# EAGLE design Wifi and Tip 120 (EAGLE 9.6.0)
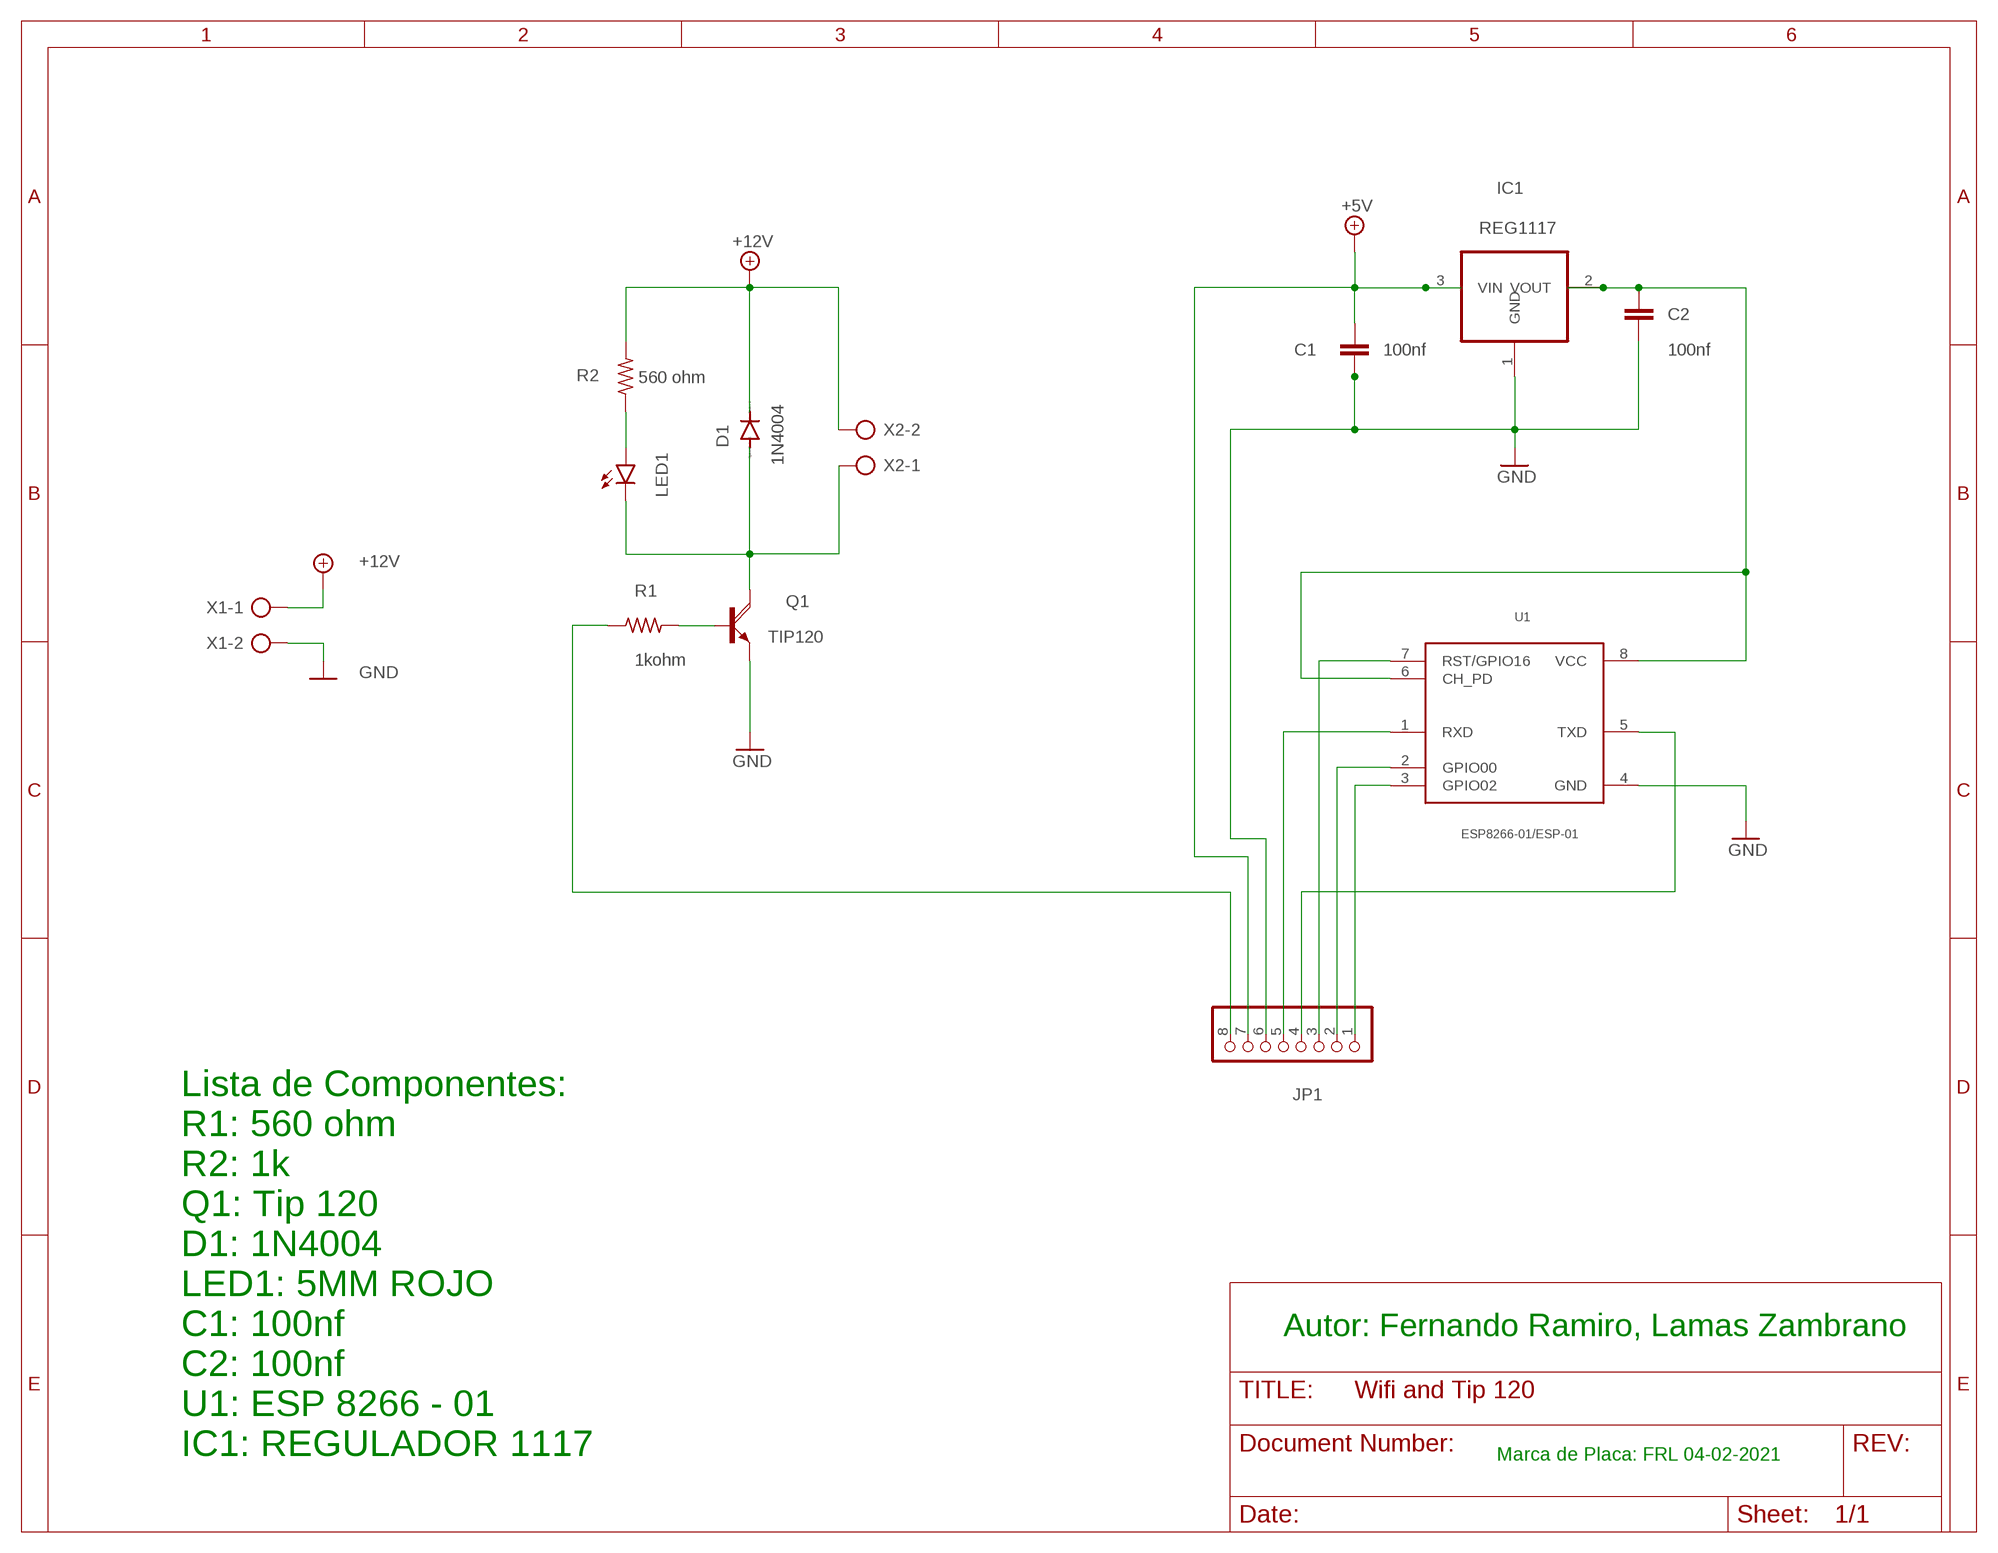
[diagram p0: schematic, sheet 1]

## Parts
C1  100nf  C-EU025-024X044  [C025-024X044]
C2  100nf  C-EU025-024X044  [C025-024X044]
D1  1N4004  [DO41-10]
IC1  REG1117  [SOT223]
JP1  PINHD-1X8  [1X08]
LED1  LED5MM  [LED5MM]
Q1  TIP120  [TO220AH]
R1  1kohm  R-US_0207/10  [0207/10]
R2  560 ohm  R-US_0207/10  [0207/10]
U1  ESP8266-01/ESP-01  [XCVR_ESP8266-01/ESP-01]
X1  AK500/2  [AK500/2]
X2  AK500/2  [AK500/2]

## Nets
+5V: C1.1 IC1.3(VIN) JP1.7
+12V: D1.C R2.2 X1.1 X2.2
GND: C1.2 C2.2 IC1.1(GND) JP1.6 Q1.E U1.4(GND) X1.2
N$1: Q1.B R1.2
N$2: D1.A LED1.K(C) Q1.C X2.1
N$3: LED1.A R2.1
N$4: JP1.8 R1.1
N$5: JP1.5 U1.1(RXD)
N$6: C2.1 IC1.2(VOUT) U1.6(CH_PD) U1.8(VCC)
N$7: JP1.4 U1.5(TXD)
N$8: JP1.3 U1.7(RST/GPIO16)
N$9: JP1.2 U1.2(GPIO00)
N$10: JP1.1 U1.3(GPIO02)

## Notes on the sheet
- Autor: Fernando Ramiro, Lamas Zambrano
- Marca de Placa: FRL 04-02-2021
- Lista de Componentes:
  R1: 560 ohm
  R2: 1k
  Q1: Tip 120
  D1: 1N4004
  LED1: 5MM ROJO
  C1: 100nf
  C2: 100nf
  U1: ESP 8266 - 01
  IC1: REGULADOR 1117

## Library data of the parts
C1 C2 = rcl:C-EU: CAPACITOR, European symbol; SPICEPREFIX: C
D1 = diode:1N4004: DIODE general purpose rectifier, 1 A
IC1 = burr-brown:REG1117: 800mA and 1A Low Dropout (LDO) Positive Regulator 1.8V, 2.5V, 2.85V, 3.3V, 5V, and Adj; MPN: REG1117; OC_FARNELL: 1097566; OC_NEWARK: 14P6981
JP1 = pinhead:PINHD-1X8: PIN HEADER
LED1 = led:LED: LED OSRAM: - CHIPLED LG R971, LG N971, LY N971, LG Q971, LY Q971, LO R971, LY R971 LH N974, LH R974 LS Q976, LO Q976, LY Q976 LO Q996 - Hyper CHIPLED LW Q18S LB Q993, LB Q99A, LB R99A - SideLED LS A670, LO A670, LY A670, LG A670, LP A670 LB A673, LV A673, LT A673, LW A673 LH A674 LY A675 LS A676, LA A676, LO A676, LY A676, LW A676 LS A679, LY A679, LG A679 - Hyper Micro SIDELED® LS Y876, LA Y876, LO Y876, LY Y876 LT Y87S - SmartLED LW L88C, LW L88S LB L89C, LB L89S, LG L890 LS L89K, LO L89K, LY L89K LS L896, LA L896, LO L896, LY L896 - TOPLED LS T670, LO T670, LY T670, LG T670, LP T670 LSG T670, LSP T670, LSY T670, LOP T670, LYG T670 LG T671, LOG T671, LSG T671 LB T673, LV T673, LT T673, LW T673 LH T674 LS T676, LA T676, LO T676, LY T676, LB T676, LH T676, LSB T676, LW T676 LB T67C, LV T67C, LT T67C, LS T67K, LO T67K, LY T67K, LW E67C LS E67B, LA E67B, LO E67B, LY E67B, LB E67C, LV E67C, LT E67C LW T67C LS T679, LY T679, LG T679 LS T770, LO T770, LY T770, LG T770, LP T770 LB T773, LV T773, LT T773, LW T773 LH T774 LS E675, LA E675, LY E675, LS T675 LS T776, LA T776, LO T776, LY T776, LB T776 LHGB T686 LT T68C, LB T68C - Hyper Mini TOPLED® LB M676 - Mini TOPLED Santana® LG M470 LS M47K, LO M47K, LY M47K Source: http://www.osram.convergy.de LUXEON: - LUMILED® LXK2-PW12-R00, LXK2-PW12-S00, LXK2-PW14-U00, LXK2-PW14-V00 LXK2-PM12-R00, LXK2-PM12-S00, LXK2-PM14-U00 LXK2-PE12-Q00, LXK2-PE12-R00, LXK2-PE12-S00, LXK2-PE14-T00, LXK2-PE14-U00 LXK2-PB12-K00, LXK2-PB12-L00, LXK2-PB12-M00, LXK2-PB14-N00, LXK2-PB14-P00, LXK2-PB14-Q00 LXK2-PR12-L00, LXK2-PR12-M00, LXK2-PR14-Q00, LXK2-PR14-R00 LXK2-PD12-Q00, LXK2-PD12-R00, LXK2-PD12-S00 LXK2-PH12-R00, LXK2-PH12-S00 LXK2-PL12-P00, LXK2-PL12-Q00, LXK2-PL12-R00 Source: www.luxeon.com KINGBRIGHT: KA-3528ASYC Source: www.kingbright.com
Q1 = transistor-power:TIP120: NPN DARLINGTON TRANSISTOR
R1 R2 = rcl:R-US_: RESISTOR, American symbol; SPICEPREFIX: R
U1 = ESP8266-01_ESP-01:ESP8266-01/ESP-01: ESP-01 wifi module; AVAILABILITY: Unavailable; DESCRIPTION: MakerFocus 4pcs ESP8266 ESP-01 Serial Wireless WiFi Transceiver Receiver Module 1MB SPI Flash DC3.0-3.6V Internet of Things WiFi Module Board Compatible con Ar duino; MF: AI-Thinker; MP: ESP8266-01/ESP-01; PACKAGE: None; PRICE: None
X1 X2 = con-ptr500:AK500/2: CONNECTOR; OC_FARNELL: unknown; OC_NEWARK: unknown

## Board
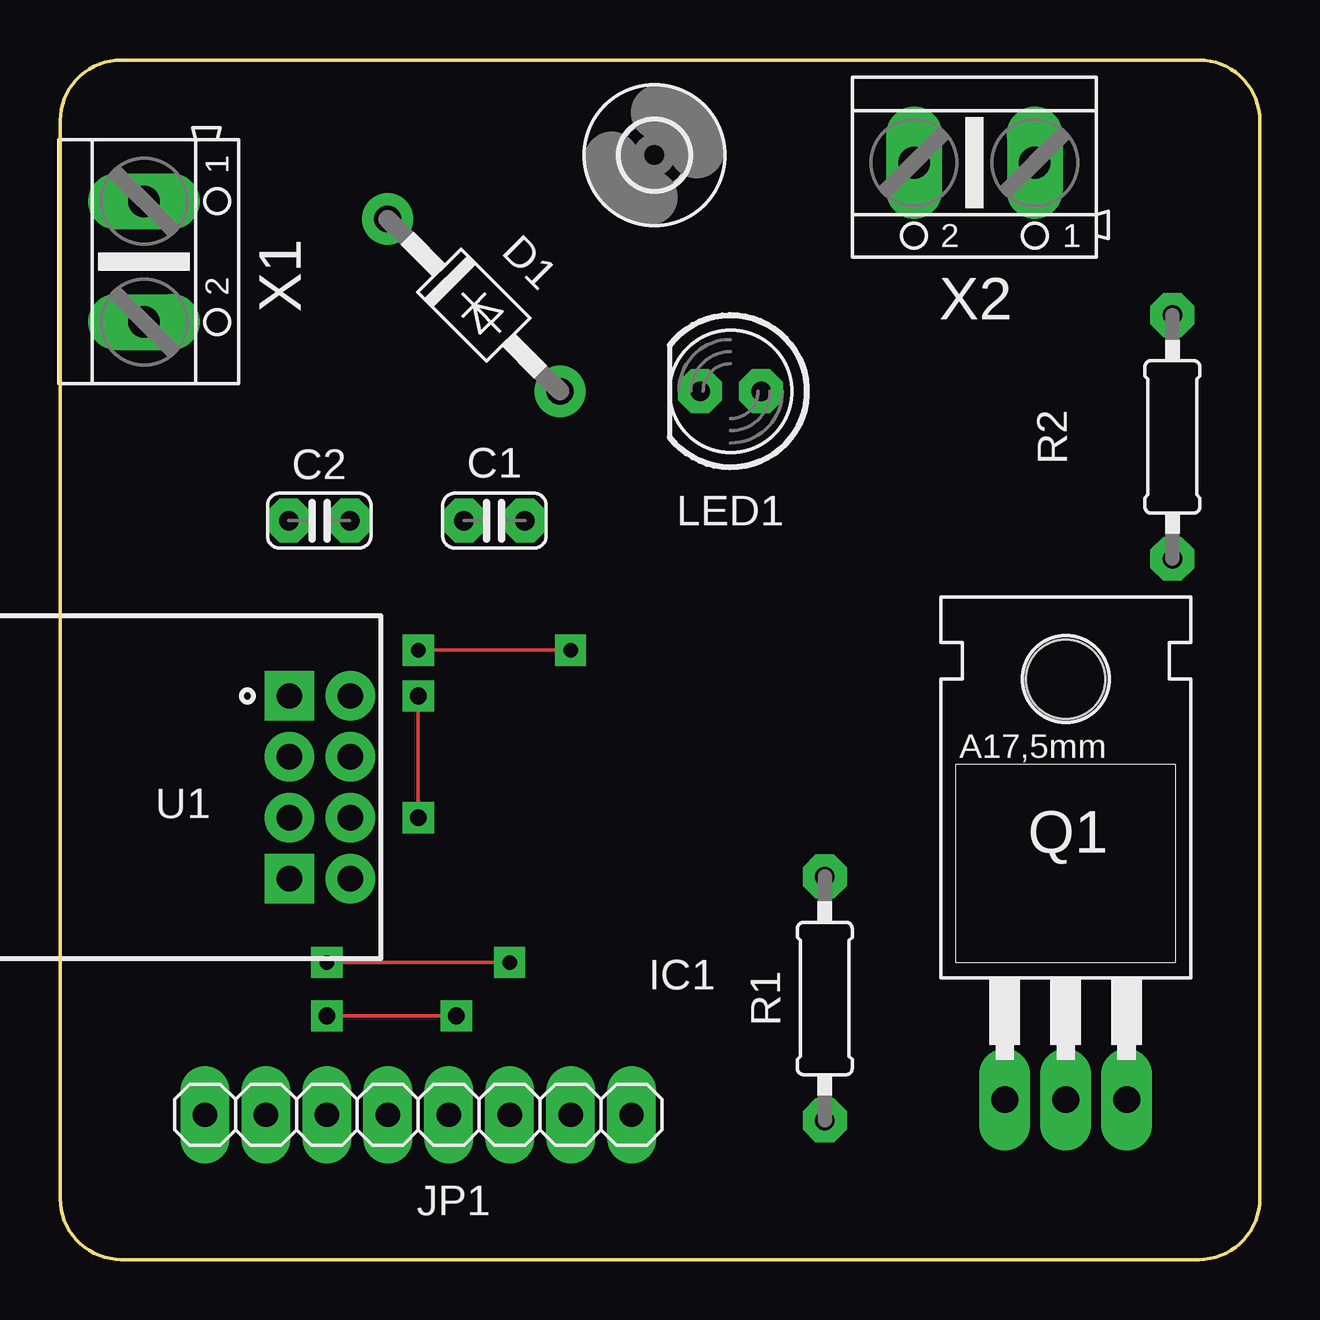
[diagram p1: board, top side]
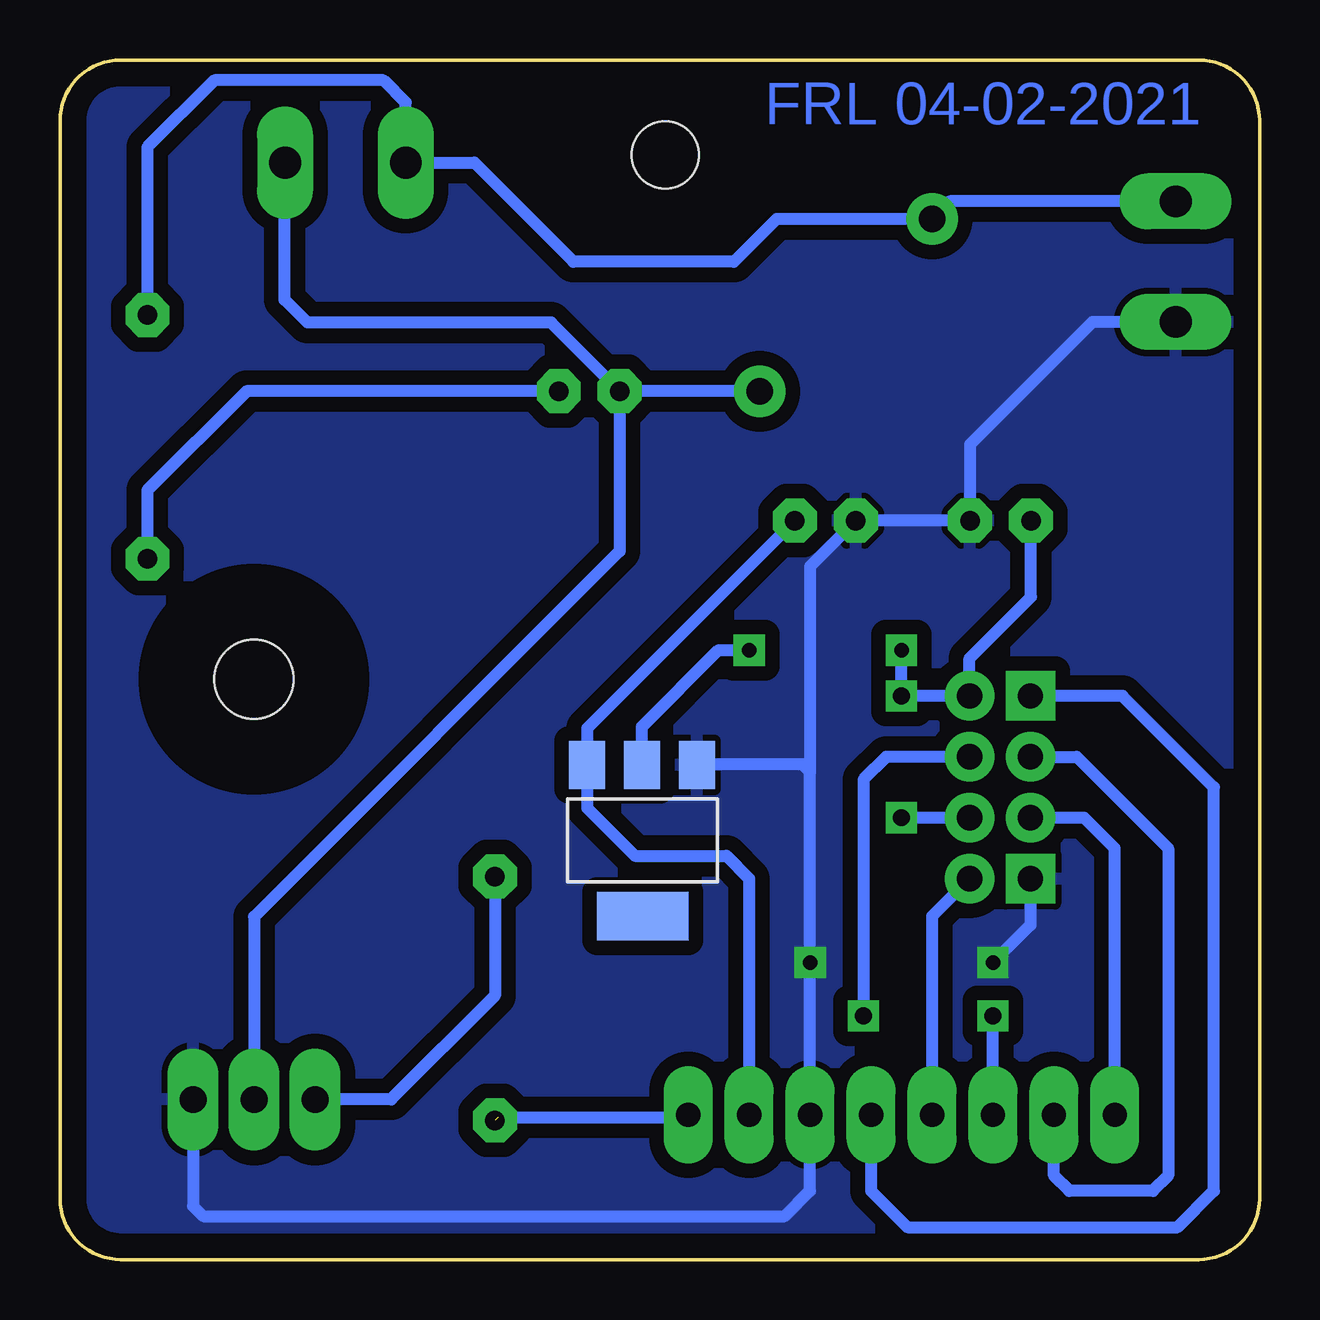
[diagram p2: board, bottom side, seen from below]

Size 50 x 50 mm. Coordinates in mm from the lower left corner, seen from the top.
Outline: 47.46,0 2.54,0 arc-90 0,2.54 0,47.46 arc-90 2.54,50 47.46,50 arc-90 50,47.46 50,2.54 arc-90 47.46,0
Copper layers (1*16): Top 0.035mm / dielectric 1.5mm / Bottom 0.035mm
Design rules "default *": minimum track width 6mil, minimum drill 0.35mm, track to track 6mil, track to pad 6mil, pad to pad 6mil, via to via 6mil, smd to smd 6mil, copper to edge 40mil, drill to drill 6mil, minimum pad ring 20mil, minimum via ring 8mil, stop-mask expansion 4mil, vias tented up to drill 0mil, thermal gap 10mil

### Footprints (pad centres in the part's own frame; a part is rotated, then mirrored left to right if it is on the bottom)
C025-024X044 = drill 0.813 octagon: 1 -1.27,0; 2 1.27,0
DO41-10 = drill 1.118: A 5.08,0; C -5.08,0
SOT223 = smd 1.499 x 2.007: 1 -2.261,-3.15; 2 0.025,-3.15; 3 2.311,-3.15 | smd 3.81 x 2.007: 4 0,3.15
1X08 = drill 1.016 long: 1 -8.89,0; 2 -6.35,0; 3 -3.81,0; 4 -1.27,0; 5 1.27,0; 6 3.81,0; 7 6.35,0; 8 8.89,0
LED5MM = drill 0.813 octagon: A -1.27,0; K 1.27,0
TO220AH = drill 1.118 long: B -2.54,-6.35; C 0,-6.35; E 2.54,-6.35 | hole 3.302: 0,11.176
0207/10 = drill 0.813 octagon: 1 -5.08,0; 2 5.08,0
XCVR_ESP8266-01/ESP-01 = drill 1.05 square: 1 0,-3.81; 4 0,3.81 | drill 1.05: 2 0,-1.27; 3 0,1.27; 5 -2.54,3.81; 6 -2.54,1.27; 7 -2.54,-1.27; 8 -2.54,-3.81
2,8 = hole 2.8: 0,0
AK500/2 = drill 1.321 long: 1 -2.515,0; 2 2.515,0

### Placement (x,y rotation side)
C1  18.1,30.8 180 top
C2  10.79,30.8 0 top
D1  17.24,39.78 315 top
IC1  25.72,17.46 180 bottom
JP1  14.92,6.03 0 top
LED1  27.94,36.2 180 top
Q1  41.91,13.02 0 top
R1  31.87,10.88 90 top
R2  46.35,34.29 90 top
U1  9.55,19.68 180 top
U$1  [2,8]  24.77,46.04 0 top
X1  3.49,41.59 270 top
X2  38.1,45.72 180 top

### Tracks (layer width: path | path; a pad name or v marks a point on that pad's centre or on a via)
+5V
  Bottom 0.508: C1.1 28.03,22.14 IC1.3 28.03,18.82 26.04,16.83 22.23,16.83 21.27,15.88 JP1.7
+12V
  Bottom 0.508: R2.2 46.35,46.35 43.56,49.15 36.51,49.15 35.59,48.22 X2.2 32.73,45.72 28.6,41.59 21.91,41.59 20.13,43.37 D1.C 12.91,44.11 X1.1
GND  (via drill 0.6 pad 1.3)
  Top 0.152: v11.11,12.38 v18.73,12.38
  Bottom 0.508: Q1.E 44.45,2.22 44.03,1.8 19.79,1.8 18.73,2.86 JP1.6 v18.73,12.38 18.73,20.32 | X1.2 6.96,39.08 12.06,33.97 C2.2 C1.2 | U1.4 9.55,13.95 v11.11,12.38 | C1.2 17.14,30.48 | 18.73,20.32 19.05,20.64 23.43,20.64 IC1.1 | C1.2 18.73,28.89 18.73,20.32
  pour Bottom (isolate 0.61): -2.22,53.34 54.61,53.34 54.93,53.02 55.24,-2.22 -1.27,-2.22 -1.59,-1.91 -2.22,-1.27 -2.22,52.7
N$1
  Bottom 0.508: R1.2 31.87,11 36.2,6.67 Q1.B
N$2
  Bottom 0.152: 40.64,45.7 X2.1
  Bottom 0.508: LED1.K 26.67,29.53 41.91,14.29 Q1.C | LED1.K 29.53,39.05 39.69,39.05 40.64,40.01 40.64,45.7 | D1.A 26.66,36.19 LED1.K
N$3
  Bottom 0.508: LED1.A 42.23,36.2 46.35,32.07 R2.1
N$4  (1 unrouted)
  Bottom 0.508: 31.73,5.94 23.91,5.94 JP1.8
N$5
  Bottom 0.508: JP1.5 16.19,2.86 14.68,1.35 3.42,1.35 1.91,2.86 1.91,19.68 5.71,23.5 U1.1
N$6  (via drill 0.6 pad 1.3, 0.7 pad 1.3)
  Top 0.152: v14.92,23.5 v14.92,18.41 | v14.92,25.4 v21.27,25.4
  Bottom 0.508: C2.1 9.53,27.62 12.09,25.06 U1.8 v14.92,23.5 v14.92,25.4 | U1.6 v14.92,18.41 | IC1.2 25.74,22.2 22.54,25.4 v21.27,25.4
N$7
  Bottom 0.508: U1.5 13.65,14.31 JP1.4
N$8  (via drill 0.7 pad 1.3)
  Top 0.152: v11.11,10.16 v16.51,10.16
  Bottom 0.508: JP1.3 v11.11,10.16 | U1.7 15.56,20.95 16.51,20 v16.51,10.16
N$9
  Bottom 0.508: U1.2 7.62,20.95 3.81,17.14 3.81,3.49 4.45,2.86 7.94,2.86 8.57,3.49 JP1.2
N$10
  Bottom 0.508: U1.3 7.3,18.41 6.03,17.14 JP1.1

### Text on the board
Bottom: FRL 04-02-2021